# Altium project Smart_Homes.PrjPcb
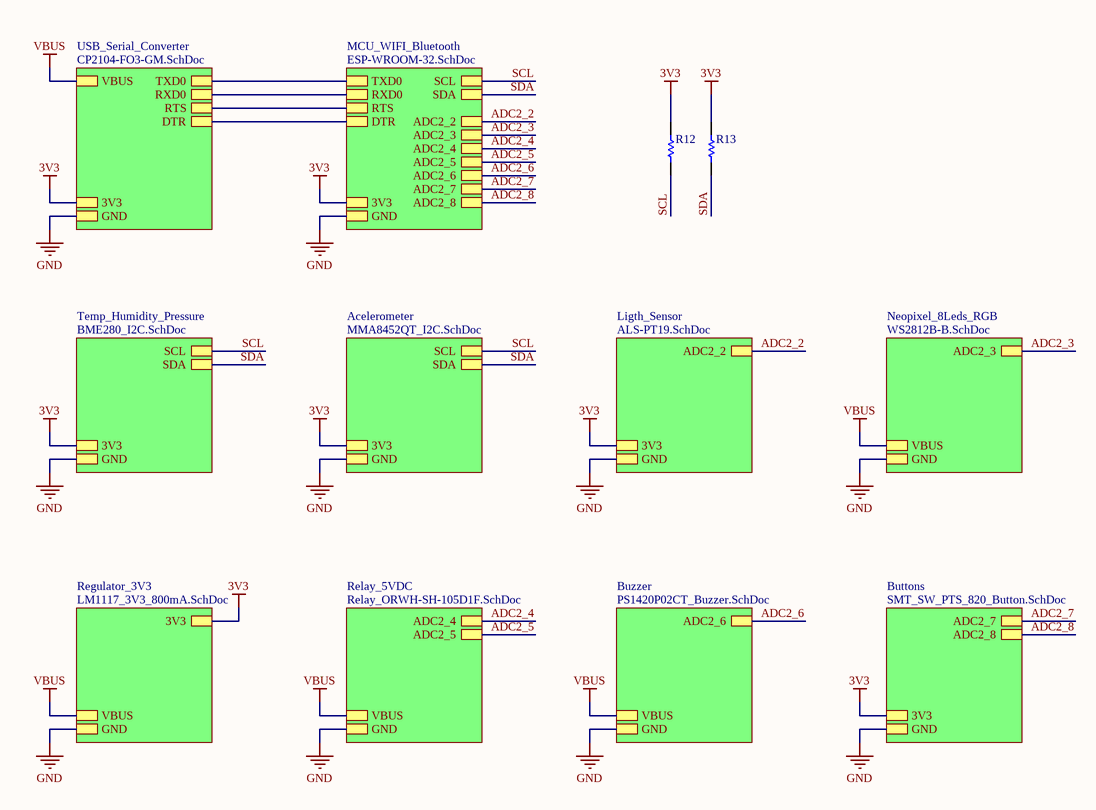
[diagram p0: Smart_Homes.SchDoc]
4 sheets, 19 parts. Net scope: hierarchical (ports join the sheet entries above them; power ports are global).
Board file: Smart_Homes.PcbDoc
Sheets:
  Smart_Homes.SchDoc
    Temp_Humidity_Pressure = BME280_I2C.SchDoc
    MCU_WIFI_Bluetooth = ESP-WROOM-32.SchDoc
    Buzzer = PS1420P02CT_Buzzer.SchDoc

## Sheet Smart_Homes.SchDoc
size A4

### Parts
R12  RK73B2ATTD103J  [RESC2013X60X30NL20T20]  (value not drawn)
R13  RK73B2ATTD103J  [RESC2013X60X30NL20T20]  (value not drawn)

### Sub-sheets
Acelerometer = MMA8452QT_I2C.SchDoc (file not in this document): SDA, SCL, GND, 3V3
Buttons = SMT_SW_PTS_820_Button.SchDoc (file not in this document): ADC2_8, GND, 3V3, ADC2_7
Buzzer = PS1420P02CT_Buzzer.SchDoc: GND, ADC2_6, VBUS
Ligth_Sensor = ALS-PT19.SchDoc (file not in this document): GND, 3V3, ADC2_2
MCU_WIFI_Bluetooth = ESP-WROOM-32.SchDoc: RTS, GND, RXD0, 3V3, SDA, DTR, TXD0, SCL, ADC2_3, ADC2_6, ADC2_2, ADC2_8, ADC2_7, ADC2_4, ADC2_5
Neopixel_8Leds_RGB = WS2812B-B.SchDoc (file not in this document): GND, VBUS, ADC2_3
Regulator_3V3 = LM1117_3V3_800mA.SchDoc (file not in this document): 3V3, GND, VBUS
Relay_5VDC = Relay_ORWH-SH-105D1F.SchDoc (file not in this document): ADC2_4, VBUS, GND, ADC2_5
Temp_Humidity_Pressure = BME280_I2C.SchDoc: GND, SDA, SCL, 3V3
USB_Serial_Converter = CP2104-FO3-GM.SchDoc (file not in this document): TXD0, DTR, RTS, RXD0, VBUS, 3V3, GND

### Nets
3V3: R12.2 R13.2 ; sheet Acelerometer/3V3, sheet Temp_Humidity_Pressure/3V3, sheet USB_Serial_Converter/3V3, sheet MCU_WIFI_Bluetooth/3V3, sheet Ligth_Sensor/3V3, sheet Regulator_3V3/3V3, sheet Buttons/3V3
GND: sheet Acelerometer/GND, sheet Temp_Humidity_Pressure/GND, sheet USB_Serial_Converter/GND, sheet MCU_WIFI_Bluetooth/GND, sheet Ligth_Sensor/GND, sheet Neopixel_8Leds_RGB/GND, sheet Regulator_3V3/GND, sheet Relay_5VDC/GND, sheet Buttons/GND, sheet Buzzer/GND
VBUS: sheet USB_Serial_Converter/VBUS, sheet Neopixel_8Leds_RGB/VBUS, sheet Regulator_3V3/VBUS, sheet Relay_5VDC/VBUS, sheet Buzzer/VBUS
ADC2_2: sheet MCU_WIFI_Bluetooth/ADC2_2, sheet Ligth_Sensor/ADC2_2
ADC2_3: sheet MCU_WIFI_Bluetooth/ADC2_3, sheet Neopixel_8Leds_RGB/ADC2_3
ADC2_4: sheet MCU_WIFI_Bluetooth/ADC2_4, sheet Relay_5VDC/ADC2_4
ADC2_5: sheet MCU_WIFI_Bluetooth/ADC2_5, sheet Relay_5VDC/ADC2_5
ADC2_6: sheet MCU_WIFI_Bluetooth/ADC2_6, sheet Buzzer/ADC2_6
ADC2_7: sheet MCU_WIFI_Bluetooth/ADC2_7, sheet Buttons/ADC2_7
ADC2_8: sheet MCU_WIFI_Bluetooth/ADC2_8, sheet Buttons/ADC2_8
DTR: sheet USB_Serial_Converter/DTR, sheet MCU_WIFI_Bluetooth/DTR
RTS: sheet USB_Serial_Converter/RTS, sheet MCU_WIFI_Bluetooth/RTS
RXD0: sheet USB_Serial_Converter/RXD0, sheet MCU_WIFI_Bluetooth/RXD0
SCL: R12.1 ; sheet Acelerometer/SCL, sheet Temp_Humidity_Pressure/SCL, sheet MCU_WIFI_Bluetooth/SCL
SDA: R13.1 ; sheet Acelerometer/SDA, sheet Temp_Humidity_Pressure/SDA, sheet MCU_WIFI_Bluetooth/SDA
TXD0: sheet USB_Serial_Converter/TXD0, sheet MCU_WIFI_Bluetooth/TXD0

### Library data of the parts
R12 R13 = CMP-2001-04657-1: 10 kOhms ±5% 0.25W, 1/4W Chip Resistor 0805 (2012 Metric) Automotive AEC-Q200, Moisture Resistant Thick Film; Manufacturer: KOA Speer; Part Number: RK73B2ATTD103J

## Sheet BME280_I2C.SchDoc
size A4
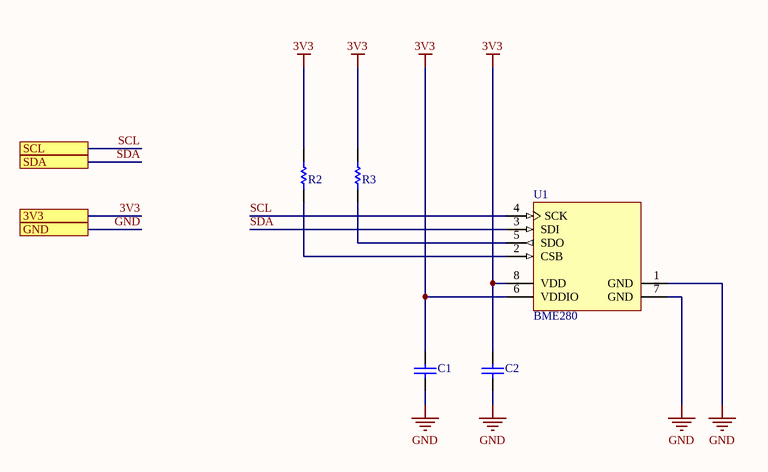
[diagram p1: BME280_I2C.SchDoc]

### Parts
C1  C0805C104J5RAC7800  [CAPC2013X145X50NL20T25]  (value not drawn)
C2  C0805C104J5RAC7800  [CAPC2013X145X50NL20T25]  (value not drawn)
R2  RC0805JR-074K7L  [RESC2013X60X30NL20T20]  (value not drawn)
R3  RC0805JR-074K7L  [RESC2013X60X30NL20T20]  (value not drawn)
U1  BME280  [BOSC-BME280-8_V]

### Ports
3V3, GND, SCL, SDA

### Nets
3V3: C1.2 C2.2 R2.2 R3.2 U1.6(VDDIO) U1.8(VDD) ; port 3V3
GND: C1.1 C2.1 U1.1(GND) U1.7(GND) ; port GND
SCL: U1.4(SCK) ; port SCL
SDA: U1.3(SDI) ; port SDA
NetR2_1: R2.1 U1.2(CSB)
NetR3_1: R3.1 U1.5(SDO)

### Library data of the parts
C1 C2 = CMP-2007-01102-1: 0.1µF ±5% 50V Ceramic Capacitor X7R 0805 (2012 Metric); Manufacturer: Kemet; Part Number: C0805C104J5RAC7800
R2 R3 = RC0805JR-074K7L: 4.7 kOhms ±5% 0.125W, 1/8W Chip Resistor 0805 (2012 Metric) Moisture Resistant Thick Film; Manufacturer: Yageo; Part Number: RC0805JR-074K7L
U1 = CMP-2000-05073-1: Combined Humidity and Pressure Sensor, 1.71 to 3.6 V, -40 to 85 degC, 8-Pin SMD, RoHS, Tape and Reel; Manufacturer: Bosch Sensortec; Datasheet Version: Rev. 1.2, 10/2015; Datasheet URL: http://datasheet.octopart.com/BME280-Bosch-datasheet-58577763.pdf; Manufacturer URL: http://www.bosch-sensortec.com; ComponentLink1Description: BME280; ComponentLink1URL: https://co.mouser.com/ProductDetail/Bosch-Sensortec/BME280?qs=sGAEpiMZZMsF1ODjcwEocB0teEbUEBlMe2ty%252bXJvNLw%3d

## Sheet ESP-WROOM-32.SchDoc
size A4
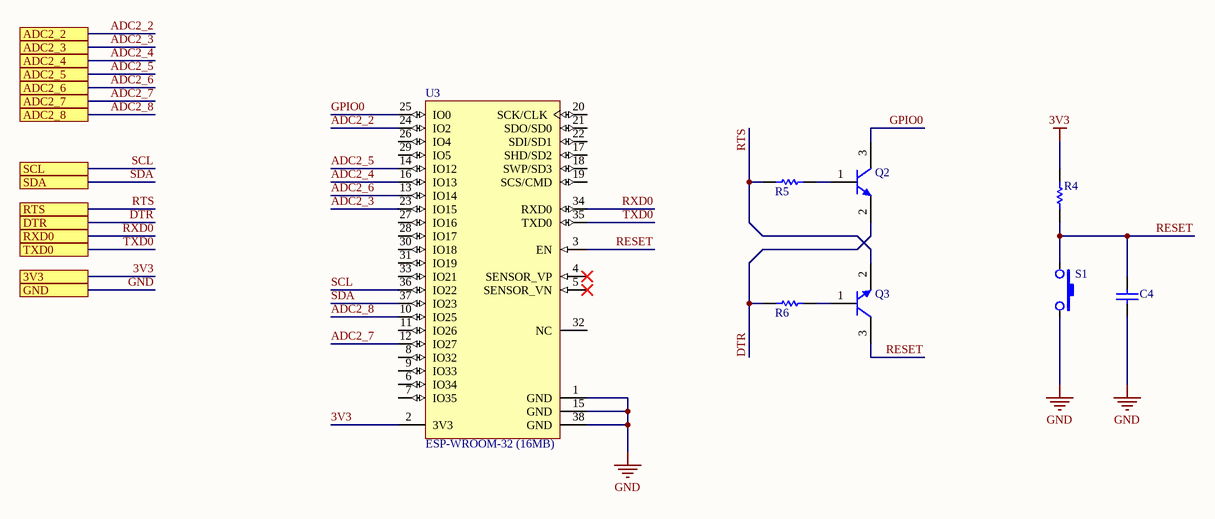
[diagram p2: ESP-WROOM-32.SchDoc]

### Parts
C4  C0805C105K4RAC7800  [CAPC2013X145X50NL20T25]  (value not drawn)
Q2  MMBT2222ALT1G  [ONSC-SOT-23-3-318-08_V]  (value not drawn)
Q3  MMBT2222ALT1G  [ONSC-SOT-23-3-318-08_V]  (value not drawn)
R4  RK73B2ATTD103J  [RESC2013X60X30NL20T20]  (value not drawn)
R5  RK73B2ATTD103J  [RESC2013X60X30NL20T20]  (value not drawn)
R6  RK73B2ATTD103J  [RESC2013X60X30NL20T20]  (value not drawn)
S1  PTS820J25MSMTRLFS  [SMT_SW_PTS_820]  (value not drawn)
U3  ESP-WROOM-32 (16MB)  [OLMX-ESP-WROOM-32]

### Ports
3V3, ADC2_2, ADC2_3, ADC2_4, ADC2_5, ADC2_6, ADC2_7, ADC2_8, DTR, GND, RTS, RXD0, SCL, SDA, TXD0

### Nets
3V3: R4.2 U3.2(3V3) ; port 3V3
GND: C4.1 S1.2 U3.1(GND) U3.15(GND) U3.38(GND) ; port GND
ADC2_2: U3.24(IO2) ; port ADC2_2
ADC2_3: U3.23(IO15) ; port ADC2_3
ADC2_4: U3.16(IO13) ; port ADC2_4
ADC2_5: U3.14(IO12) ; port ADC2_5
ADC2_6: U3.13(IO14) ; port ADC2_6
ADC2_7: U3.12(IO27) ; port ADC2_7
ADC2_8: U3.10(IO25) ; port ADC2_8
DTR: Q2.2(E) R6.2 ; port DTR
GPIO0: Q2.3(C) U3.25(IO0)
RESET: C4.2 Q3.3(C) R4.1 S1.1 U3.3(EN)
RTS: Q3.2(E) R5.2 ; port RTS
RXD0: U3.34(RXD0) ; port RXD0
SCL: U3.36(IO22) ; port SCL
SDA: U3.37(IO23) ; port SDA
TXD0: U3.35(TXD0) ; port TXD0
NetQ2_1: Q2.1(B) R5.1
NetQ3_1: Q3.1(B) R6.1

Not connected (* = marked no-connect by the designer): U3 4(SENSOR_VP)* 5(SENSOR_VN)* 6(IO34) 7(IO35) 8(IO32) 9(IO33) 11(IO26) 17(SHD/SD2) 18(SWP/SD3) 19(SCS/CMD) 20(SCK/CLK) 21(SDO/SD0) 22(SDI/SD1) 26(IO4) 27(IO16) 28(IO17) 29(IO5) 30(IO18) 31(IO19) 32(NC) 33(IO21)

### Library data of the parts
C4 = CMP-2007-01082-1: 1µF ±10% 16V Ceramic Capacitor X7R 0805 (2012 Metric); Manufacturer: Kemet; Part Number: C0805C105K4RAC7800
Q2 Q3 = CMP-1048-00538-1: General Purpose Transistor, NPN Silicon, 3-Pin SOT-23, Pb-Free, Tape and Reel; Manufacturer: On Semiconductor; fT Min (MHz): 300; IC Continuous (A): 0.6; ComponentLink3URL: http://www.onsemi.cn/pub_link/Collateral/318-08.PDF; PartNumber: MMBT2222ALT1G; RoHS: TRUE; ComponentLink1URL: http://www.onsemi.com/; ComponentLink3Description: Package Specification; ComponentLink2Description: Datasheet; Mounting Technology: Surface Mount; Packing: Tape and Reel; PackageDescription: 3-Pin Small Outline Transistor, Body 2.92 x 1.3 mm, Pitch 0.95 mm; DatasheetVersion: Rev. 10; PackageReference: SOT-23-3-318-08; ComponentLink2URL: http://www.onsemi.cn/pub_link/Collateral/MMBT2222LT1-D.PDF; Polarity: NPN; PackageVersion: Rev. AP, 11/2009; ComponentLink1Description: Manufacturer URL
R4-R6 = CMP-2001-04657-1: as R12 on sheet Smart_Homes; Part Number: RK73B2ATTD103J
S1 = PTS820J25MSMTRLFS: Tactile Switch SPST-NO Top Actuated Surface Moun
U3 = CMP-2000-07454-1: Espressif System, 2.7 to 3.6 V, -40 to 85 degC, 38-Pin SMD; Package Description: 38-Pin Surface Mount Device, Body 18 x 25.5 mm, Pitch 1.27 mm; RoHSCompliant: false; Mounting Technology: SurfaceMount; Package Reference: ESP-WROOM-32 (16MB)

## Sheet PS1420P02CT_Buzzer.SchDoc
size A4
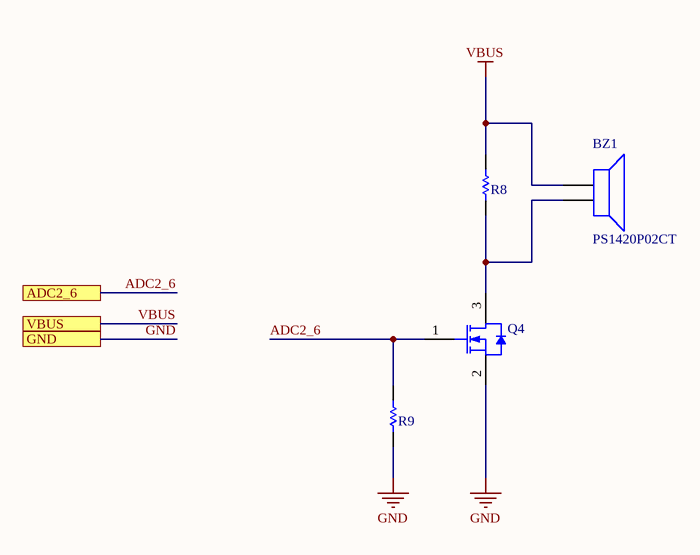
[diagram p3: PS1420P02CT_Buzzer.SchDoc]

### Parts
BZ1  PS1420P02CT  [Buzz_14mm]
Q4  BSS138-7-F  [DIOD-SOT23-3_V]  (value not drawn)
R8  ERJ-P06J102V  [RESC2013X70X40NL20T20]  (value not drawn)
R9  RK73B2ATTD103J  [RESC2013X60X30NL20T20]  (value not drawn)

### Ports
ADC2_6, GND, VBUS

### Nets
GND: Q4.2(S) R9.2 ; port GND
VBUS: BZ1.2 R8.2 ; port VBUS
ADC2_6: Q4.1(G) R9.1 ; port ADC2_6
NetBZ1_1: BZ1.1 Q4.3(D) R8.1

### Library data of the parts
BZ1 = PS1420P02CT: Buzzers Transducer, Externally Driven Piezo 5V 2kHz 70dB @ 5V, 10cm Through Hole PC Pins
Q4 = CMP-2000-04930-1: N-Channel Enhancement Mode Mosfet, 50 V, 0.2 A, -55 to 150 degC, 3-Pin SOT23, RoHS, Tape and Reel; Manufacturer: Diodes Inc; Brand: DiodesIncorporated; Unit Weight: 0.000282oz; Pd - Power Dissipation: 300mW; Id - Continuous Drain Current: 200mA; Rds On - Drain-Source Resistance: 3.5Ohms; Vgs - Gate-Source Voltage: 20V; Number of Channels: 1Channel; Vds - Drain-Source Breakdown Voltage: 50V; Transistor Type: 1N-Channel; Typical Turn-Off Delay Time: 20ns; Configuration: Single; Mounting Style: SMD/SMT; Height: 1mm; Package Description: 3-Pin Small Outline Transistor, Body 2.9 x 1.3 mm, Pitch 0.96 mm; Datasheet Version: Rev. 20-2, 11/2013; Minimum Operating Temperature: -55C; Package / Case: SOT-23-3; Channel Mode: Enhancement; Product: MOSFETSmallSignal; Packaging: Reel; Maximum Operating Temperature: +150C; Datasheet URL: https://datasheet.ciiva.com/8115/ds30144-8115344.pdf; Product Category: MOSFET; Width: 1.3mm; Technology: Si; Package Reference: SOT23-3; Manufacturer URL: http://www.diodes.com/; Transistor Polarity: N-Channel; Length: 2.9mm; Factory Pack Quantity: 3000; Series: BSS138; RoHS: True; Typical Turn-On Delay Time: 20ns
R8 = CMP-2001-00477-1: RES SMD 1K OHM 5% 1/2W 0805; Manufacturer: Panasonic; Part Number: ERJ-P06J102V
R9 = CMP-2001-04657-1: as R12 on sheet Smart_Homes; Part Number: RK73B2ATTD103J

## Nets that join several sheets
3V3: Smart_Homes (R12.2 R13.2), BME280_I2C (6 pins), ESP-WROOM-32 (R4.2 U3.2)
GND: BME280_I2C (C1.1 C2.1 U1.1 U1.7), ESP-WROOM-32 (5 pins), PS1420P02CT_Buzzer (Q4.2 R9.2)
ADC2_6: ESP-WROOM-32 (U3.13), PS1420P02CT_Buzzer (Q4.1 R9.1)
SCL: Smart_Homes (R12.1), BME280_I2C (U1.4), ESP-WROOM-32 (U3.36)
SDA: Smart_Homes (R13.1), BME280_I2C (U1.3), ESP-WROOM-32 (U3.37)